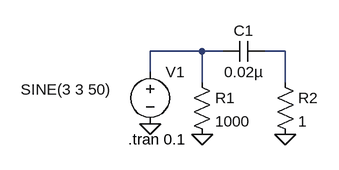
[diagram p0: schematic electronics_cap_reactance_ex1.asc]
electronics_cap_reactance_ex1.asc, the LTspice schematic file:
Version 4
SHEET 1 880 680
WIRE 144 80 64 80
WIRE 176 80 144 80
WIRE 272 80 240 80
WIRE 64 112 64 80
WIRE 144 128 144 80
WIRE 272 128 272 80
FLAG 64 192 0
FLAG 144 208 0
FLAG 272 208 0
SYMBOL voltage 64 96 R0
WINDOW 3 -199 43 Left 2
WINDOW 123 0 0 Left 0
WINDOW 39 0 0 Left 0
SYMATTR InstName V1
SYMATTR Value SINE(3 3 50)
SYMBOL cap 240 64 R90
WINDOW 0 0 32 VBottom 2
WINDOW 3 32 32 VTop 2
SYMATTR InstName C1
SYMATTR Value 0.02µ
SYMBOL res 128 112 R0
SYMATTR InstName R1
SYMATTR Value 1000
SYMBOL res 256 112 R0
SYMATTR InstName R2
SYMATTR Value 1
TEXT 30 216 Left 2 !.tran 0.1

The netlist it stands for:
* electronics_cap_reactance_ex1.asc
V1 N001 0 SINE(3 3 50)
C1 N002 N001 0.02µ
R1 N001 0 1000
R2 N002 0 1
.tran 0.1
.backanno
.end